# Altium schematic sheet PowerSupply.SchDoc
size A4
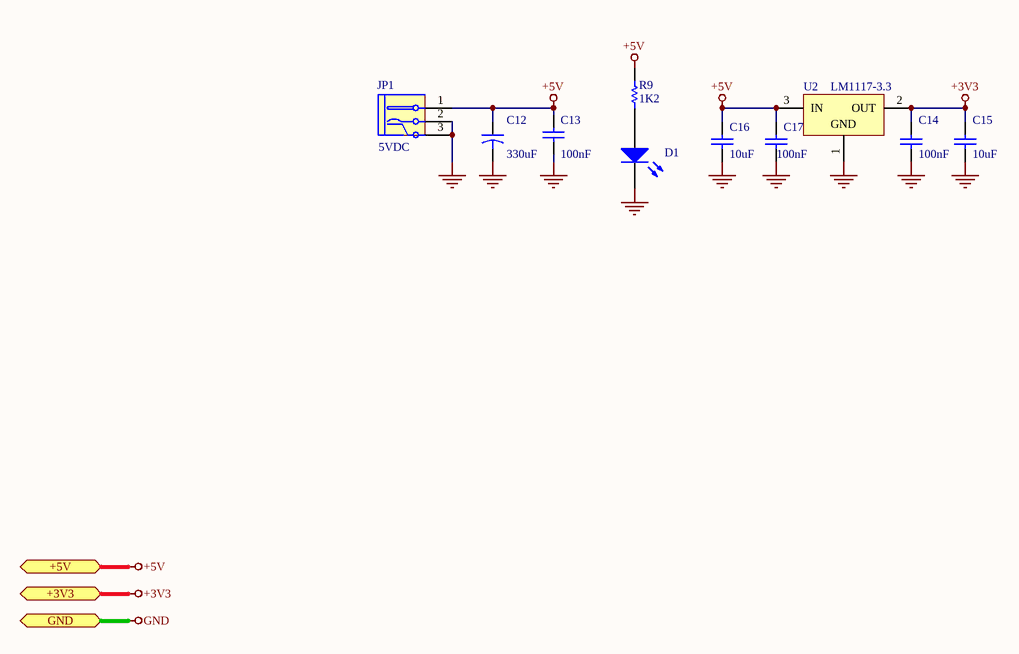
[diagram p0: PowerSupply.SchDoc]

## Parts
C12  value 330uF  [C-ALU-10x10.2mm]  (hidden comment: 330uF/50V)
C13  value 100nF  [C-0805]  (hidden comment: 104)
C14  value 100nF  [C-0805]  (hidden comment: 104)
C15  value 10uF  [C-0805]  (hidden comment: 106)
C16  value 10uF  [C-0805]  (hidden comment: 106)
C17  value 100nF  [C-0805]  (hidden comment: 104)
D1  SMD0805-RED  [LED-0805]  (value not drawn)
JP1  value 5VDC  [TER-JACKDC-5.5x2.1mm]  (hidden comment: JackDC5.5x2.5)
R9  1K2  [R-0805]
U2  LM1117-3.3  [SOT-223-3]

## Ports
+3V3, +5V, GND

## Nets
+3V3: C14.1 C15.1 U2.2(OUT) ; port +3V3
+5V: C12.1 C13.1 C16.1 C17.1 JP1.1(T) R9.2 U2.3(IN) ; port +5V
GND: C12.2 C13.2 C14.2 C15.2 C16.2 C17.2 D1.2(K) JP1.2(TN) JP1.3(S) U2.1(GND) ; port GND
NetD1_1: D1.1(A) R9.1

## Library data of the parts
C12 = Cap2: 100UF 50V 10x10.2MM; Published: 23-Sep-2002; PackageReference: CAPR5-4X5; Publisher: Altium Limited
C13-C17 = Cap: Capacitor; Published: 8-Jun-2000; LatestRevisionDate: 17-Jul-2002; LatestRevisionNote: Re-released for DXP Platform.; PackageReference: RAD-0.3; Publisher: Altium Limited
D1 = LED0: Typical INFRARED GaAs LED; Value: PowerLed; Published: 8-Jun-2000; LatestRevisionDate: 08-Jul-2005; LatestRevisionNote: Mech Layer 1 removed.; PackageReference: LED-0
JP1 = JACK DC12V: Jack DC5.5x2.5MM DC5525
R9 = Res1: Resistor; Published: 8-Jun-2000; LatestRevisionDate: 17-Jul-2002; LatestRevisionNote: Re-released for DXP Platform.; PackageReference: AXIAL-0.3; Publisher: Altium Limited; PackageDescription: Axial Device, Thru-Hole; 2 Leads; 0.3 in Pin Spacing; Value: 1K2
U2 = LM1117DT-3.3: 800mA Low-Dropout Linear Regulator, 3-pin TO-252; Manufacturer: National Semiconductor; PackageTopMarking: NSUZXYTT*LM1117*DT-3.3; PowerWise: N; CompType: LDO IC; Published: 4-Dec-2008; DatasheetVersion: Apr-2006; PackageVersion: revD, Feb-2009; PackageReference: TD03B; Publisher: Altium Limited; PackageDescription: TO252, Molded, Jedec, 6.8 x 6.10 x 2.30mm Body, 3 Lead, 2.28mm Pitch, Surface Mount; Supplier 1: Farnell; Supplier Part Number 1: 9486275; Supplier 2: Farnell; Supplier Part Number 2: 1523829; PartNumber: LM1117DT-3.3; RoHS: N; PinCount: 3; Code_JEDEC: TO-252-AA; ComponentLink1Description: LM1117 Datasheet; ComponentLink1URL: http://www.national.com/ds/LM/LM1117.pdf; ComponentLink2Description: LM1117 Web Page; ComponentLink2URL: http://www.national.com/pf/LM/LM1117.html; ComponentLink3Description: TD03B Package Page; ComponentLink3URL: http://www.national.com/packaging/folders/td03b.html; Value: LM1117-3.3